# Altium schematic sheet southside.schdoc: South Side Connector
size 431 x 279 mm; DrawnBy: D. Bruey, M.Ciuffo; Organization: Synapse Product Development, LLC.; Address1: 1511 6th Ave., Suite 400; Address2: Seattle, Washington 98101; Address3: 206.381.0898; Address4: www.synapse.com; DocumentNumber: 12; SheetNumber: 9; SheetTotal: 10; PageSetup: Record=PageOptions|CenterHorizontal=True|CenterVertical=True|PrintScale=0.98|XCorrection=1.00|YCorrection=1.00|PrintKind=1|BorderSize=5000000|LeftOffset=0|BottomOffset=0|Orientation=2|PaperLength=4318|PaperWidth=2794|Scale=100|PaperSource=7|PrintQuality=200|MediaType=1|DitherType=10|PrintScaleMode=1|PaperKind=11x17|PaperIndex=3
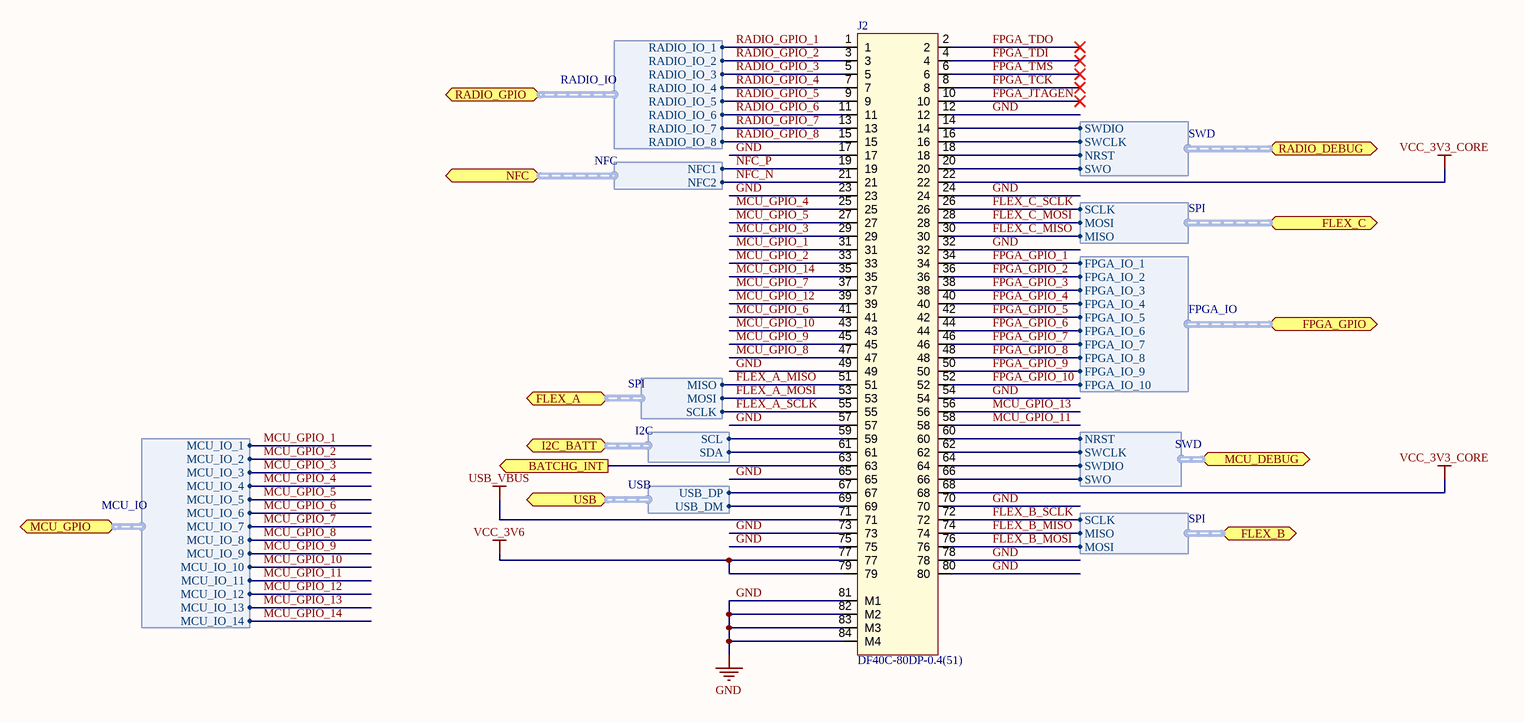
[diagram p0: southside.schdoc]

## Parts
J2  DF40C-80DP-0.4(51)  [con80_hirose-df40c-80dp_129h]

## Ports
BATCHG_INT (out), FLEX_A (harness SPI), FLEX_B (harness SPI), FLEX_C (harness SPI), FPGA_GPIO (harness FPGA_IO), I2C_BATT (harness I2C), MCU_DEBUG (harness SWD), MCU_GPIO (harness MCU_IO), NFC (harness NFC), RADIO_DEBUG (harness SWD), RADIO_GPIO (harness RADIO_IO), USB (harness USB)

## Harnesses
SPI: MOSI, MISO, SCLK
USB: USB_DM, USB_DP
I2C: SDA, SCL
RADIO_IO: RADIO_IO_1, RADIO_IO_2, RADIO_IO_3, RADIO_IO_4, RADIO_IO_5, RADIO_IO_6, RADIO_IO_7, RADIO_IO_8
NFC: NFC2, NFC1
SWD: NRST, SWCLK, SWDIO, SWO
MCU_IO: MCU_IO_1, MCU_IO_2, MCU_IO_3, MCU_IO_4, MCU_IO_5, MCU_IO_6, MCU_IO_7, MCU_IO_8, MCU_IO_9, MCU_IO_10, MCU_IO_11, MCU_IO_12, MCU_IO_13, MCU_IO_14
FPGA_IO: FPGA_IO_2, FPGA_IO_3, FPGA_IO_4, FPGA_IO_5, FPGA_IO_6, FPGA_IO_7, FPGA_IO_8, FPGA_IO_9, FPGA_IO_10, FPGA_IO_1

## Nets
GND: J2.12 J2.17 J2.23 J2.24 J2.32 J2.49 J2.54 J2.57 J2.65 J2.70 J2.73 J2.75 J2.78 J2.80 J2.81(M1) J2.82(M2) J2.83(M3) J2.84(M4)
USB_VBUS: J2.71
VCC_3V3_CORE: J2.22 J2.68
VCC_3V6: J2.77 J2.79
BATCHG_INT: J2.63 ; port BATCHG_INT
FLEX_A_MISO: J2.51 ; port FLEX_A.MISO
FLEX_A_MOSI: J2.53 ; port FLEX_A.MOSI
FLEX_A_SCLK: J2.55 ; port FLEX_A.SCLK
FLEX_B_MISO: J2.74 ; port FLEX_B.MISO
FLEX_B_MOSI: J2.76 ; port FLEX_B.MOSI
FLEX_B_SCLK: J2.72 ; port FLEX_B.SCLK
FLEX_C_MISO: J2.30 ; port FLEX_C.MISO
FLEX_C_MOSI: J2.28 ; port FLEX_C.MOSI
FLEX_C_SCLK: J2.26 ; port FLEX_C.SCLK
FPGA_GPIO_1: J2.34 ; port FPGA_GPIO.FPGA_IO_1
FPGA_GPIO_2: J2.36 ; port FPGA_GPIO.FPGA_IO_2
FPGA_GPIO_3: J2.38 ; port FPGA_GPIO.FPGA_IO_3
FPGA_GPIO_4: J2.40 ; port FPGA_GPIO.FPGA_IO_4
FPGA_GPIO_5: J2.42 ; port FPGA_GPIO.FPGA_IO_5
FPGA_GPIO_6: J2.44 ; port FPGA_GPIO.FPGA_IO_6
FPGA_GPIO_7: J2.46 ; port FPGA_GPIO.FPGA_IO_7
FPGA_GPIO_8: J2.48 ; port FPGA_GPIO.FPGA_IO_8
FPGA_GPIO_9: J2.50 ; port FPGA_GPIO.FPGA_IO_9
FPGA_GPIO_10: J2.52 ; port FPGA_GPIO.FPGA_IO_10
FPGA_JTAGEN: J2.10
FPGA_TCK: J2.8
FPGA_TDI: J2.4
FPGA_TDO: J2.2
FPGA_TMS: J2.6
MCU_GPIO_1: J2.31 ; port MCU_GPIO.MCU_IO_1
MCU_GPIO_2: J2.33 ; port MCU_GPIO.MCU_IO_2
MCU_GPIO_3: J2.29 ; port MCU_GPIO.MCU_IO_3
MCU_GPIO_4: J2.25 ; port MCU_GPIO.MCU_IO_4
MCU_GPIO_5: J2.27 ; port MCU_GPIO.MCU_IO_5
MCU_GPIO_6: J2.41 ; port MCU_GPIO.MCU_IO_6
MCU_GPIO_7: J2.37 ; port MCU_GPIO.MCU_IO_7
MCU_GPIO_8: J2.47 ; port MCU_GPIO.MCU_IO_8
MCU_GPIO_9: J2.45 ; port MCU_GPIO.MCU_IO_9
MCU_GPIO_10: J2.43 ; port MCU_GPIO.MCU_IO_10
MCU_GPIO_11: J2.58 ; port MCU_GPIO.MCU_IO_11
MCU_GPIO_12: J2.39 ; port MCU_GPIO.MCU_IO_12
MCU_GPIO_13: J2.56 ; port MCU_GPIO.MCU_IO_13
MCU_GPIO_14: J2.35 ; port MCU_GPIO.MCU_IO_14
NFC_N: J2.21 ; port NFC.NFC2
NFC_P: J2.19 ; port NFC.NFC1
RADIO_GPIO_1: J2.1 ; port RADIO_GPIO.RADIO_IO_1
RADIO_GPIO_2: J2.3 ; port RADIO_GPIO.RADIO_IO_2
RADIO_GPIO_3: J2.5 ; port RADIO_GPIO.RADIO_IO_3
RADIO_GPIO_4: J2.7 ; port RADIO_GPIO.RADIO_IO_4
RADIO_GPIO_5: J2.9 ; port RADIO_GPIO.RADIO_IO_5
RADIO_GPIO_6: J2.11 ; port RADIO_GPIO.RADIO_IO_6
RADIO_GPIO_7: J2.13 ; port RADIO_GPIO.RADIO_IO_7
RADIO_GPIO_8: J2.15 ; port RADIO_GPIO.RADIO_IO_8
NetJ2_14: J2.14 ; port RADIO_DEBUG.SWDIO
NetJ2_16: J2.16 ; port RADIO_DEBUG.SWCLK
NetJ2_18: J2.18 ; port RADIO_DEBUG.NRST
NetJ2_20: J2.20 ; port RADIO_DEBUG.SWO
NetJ2_59: J2.59 ; port I2C_BATT.SCL
NetJ2_60: J2.60 ; port MCU_DEBUG.NRST
NetJ2_61: J2.61 ; port I2C_BATT.SDA
NetJ2_62: J2.62 ; port MCU_DEBUG.SWCLK
NetJ2_64: J2.64 ; port MCU_DEBUG.SWDIO
NetJ2_66: J2.66 ; port MCU_DEBUG.SWO
NetJ2_67: J2.67 ; port USB.USB_DP
NetJ2_69: J2.69 ; port USB.USB_DM

## Notes on the sheet
- Design Notes:
- Layout Notes:
- Project:
- Sheet Title:
- PCBA:
- PROPRIETARY AND CONFIDENTIAL
- Drawn by:
- Schematic Part Number:
- Schematic Revision:
- Date:
- Sheet:
- /

## Library data of the parts
J2 = DF40C-80DP-0.4(51): CONN HDR 80POS 0.4MM SMD GOLD; part_type: connector; id: 1581; mfg: Hirose; dist: Digikey; dist_pn: H11632CT-ND; symbol: \\synapsedev.com\dfs\FS\EE_STUFF\CAD_LIB\MASTER\MASTER_CON\DF40C-80DP-0.4(51); voltage: 30; positions: 80; TableName: viewAltiumConnectors; mfg_pn: DF40C-80DP-0.4(51); allegro_footprint: con80_hirose-df40c-80dp_129h; height: 1.14mm; status: Unknown; datasheet: http://www.hirose.co.jp/cataloge_hp/ed_DF40_20140305.pdf